# EAGLE design ThermoBot (EAGLE 7.6.0)
AUTHOR: w. boyett; CONTACT_ADDRESS: Licensed under CC-BY-SA; CONTACT_COMPANY: github.com/watsonboyett; CONTACT_PHONE: (Creative Commons, Attribution + Share Alike); REV: 1B
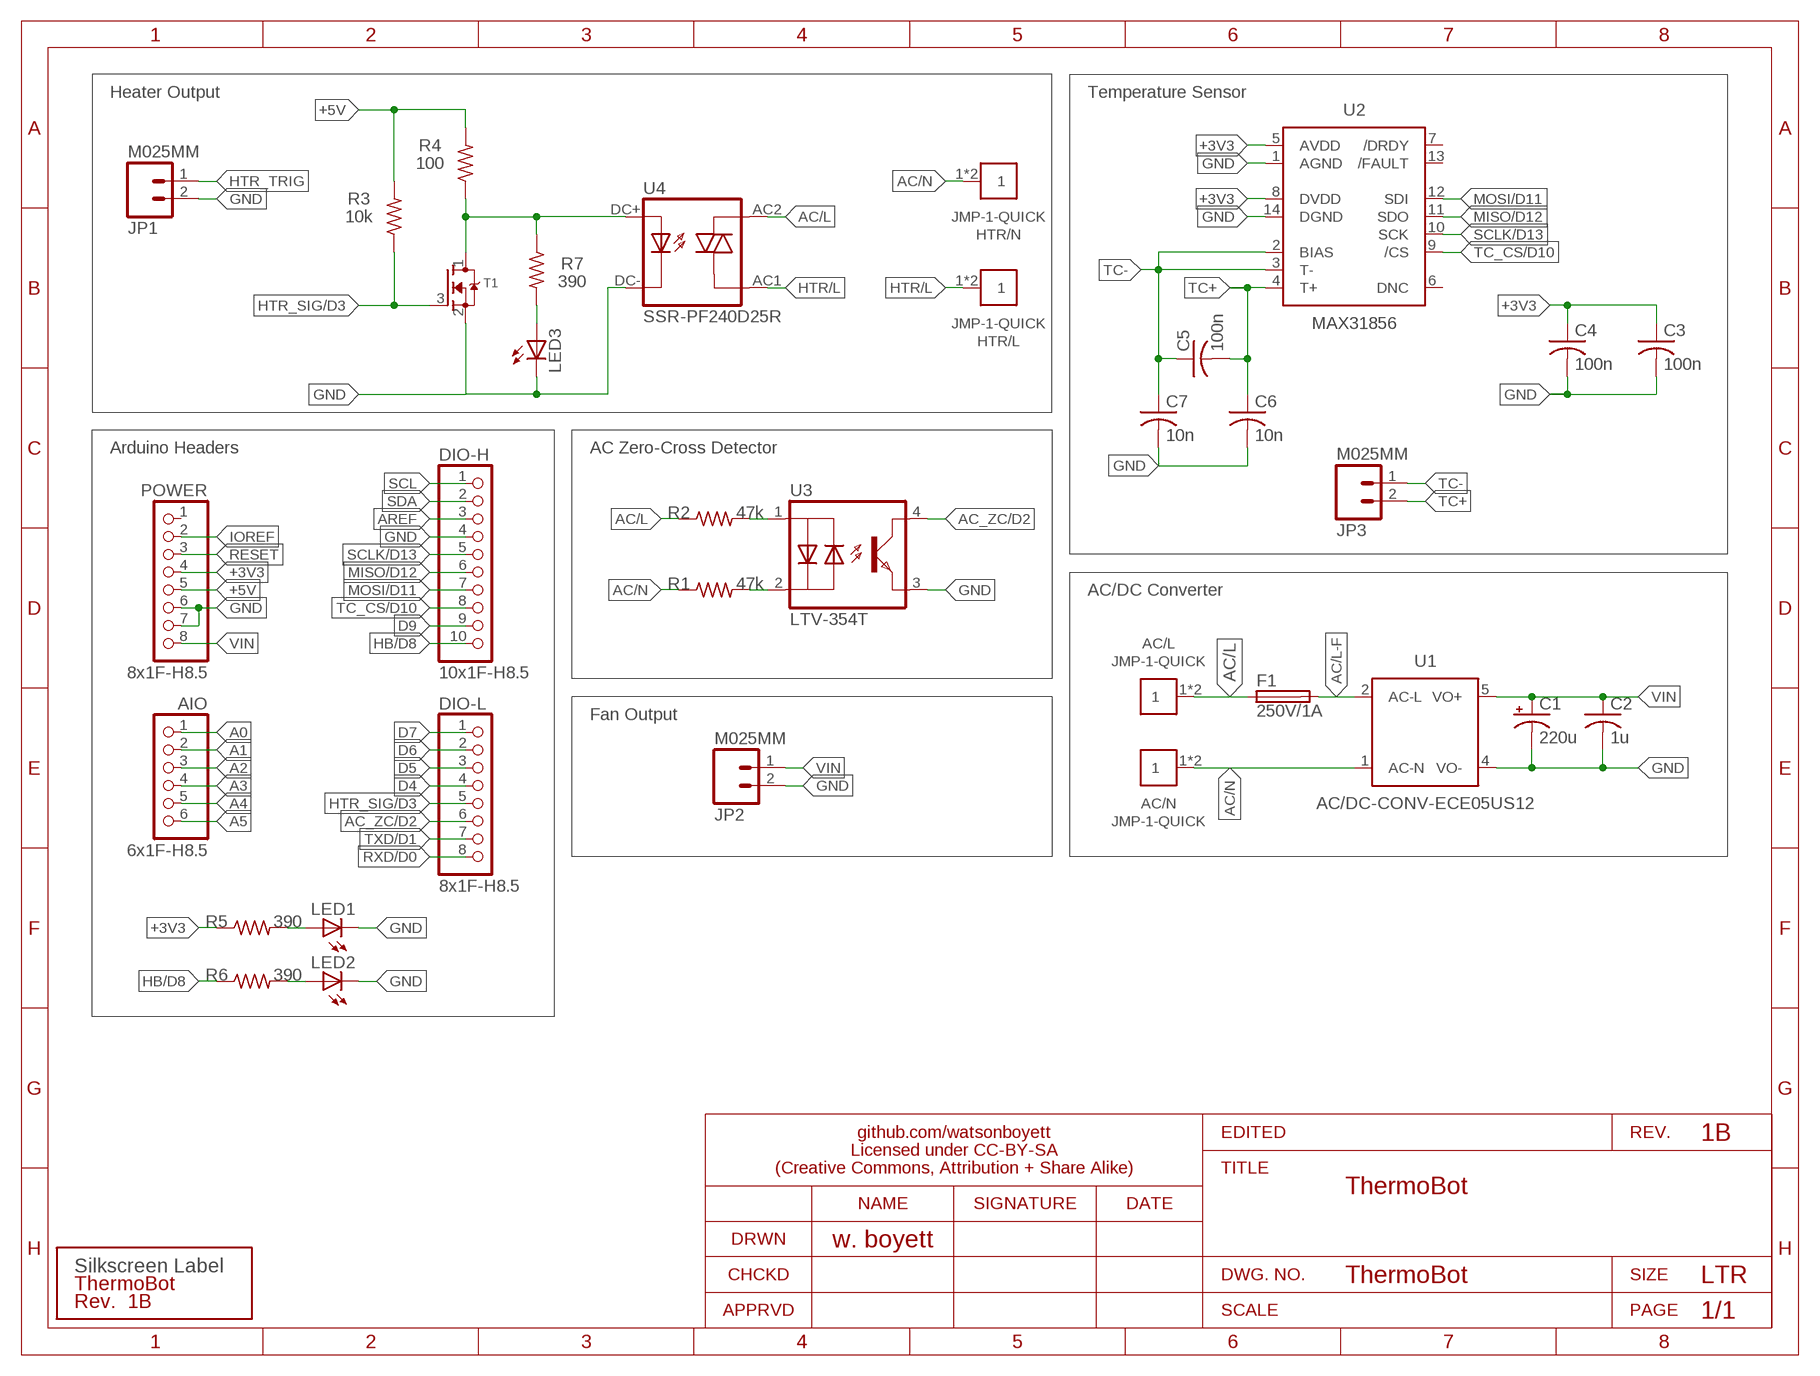
[diagram p0: schematic, sheet 1]

## Parts
AC/L  JMP-1-QUICK  [QUICK-1]
AC/N  JMP-1-QUICK  [QUICK-1]
AIO  6x1F-H8.5  PINHD-1X6TH  [1X06]
C1  220u  CPOL-US153CLV-1014  [153CLV-1014]
C2  1u  C-USC0805  [C0805]
C3  100n  C-USC0805  [C0805]
C4  100n  C-USC0805  [C0805]
C5  100n  C-USC0805  [C0805]
C6  10n  C-USC0805  [C0805]
C7  10n  C-USC0805  [C0805]
DIO-H  10x1F-H8.5  PINHD-1X10TH  [1X10]
DIO-L  8x1F-H8.5  PINHD-1X8TH  [1X08]
F1  250V/1A  FUSE2410  [2SMD-2410]
HTR/L  JMP-1-QUICK  [QUICK-1]
HTR/N  JMP-1-QUICK  [QUICK-1]
JP1  M025MM  [SCREWTERMINAL-5MM-2]
JP2  M025MM  [SCREWTERMINAL-5MM-2]
JP3  M025MM  [SCREWTERMINAL-5MM-2]
LED1  LEDCHIP-LED0805  [CHIP-LED0805]
LED2  LEDCHIP-LED0805  [CHIP-LED0805]
LED3  LEDCHIP-LED0805  [CHIP-LED0805]
POWER  8x1F-H8.5  PINHD-1X8TH  [1X08]
R1  47k  R-US_R1206  [R1206]
R2  47k  R-US_R1206  [R1206]
R3  10k  R-US_R0805  [R0805]
R4  100  R-US_R0805  [R0805]
R5  390  R-US_R0805  [R0805]
R6  390  R-US_R0805  [R0805]
R7  390  R-US_R0805  [R0805]
T1  MOSFET-N-SOT23  [SOT-23]
U1  AC/DC-CONV-ECE05US12  [ECE05]
U2  MAX31856  [TSSOP14]
U3  LTV-354T  [SOP-4]
U4  SSR-PF240D25R  [SIP-4]
U$1  SILK_QC  [SILK_QC]

## Nets
+3V3: C3.1 C4.1 POWER.4 R5.1 U2.5(AVDD) U2.8(DVDD)
+5V: POWER.5 R3.2 R4.2
A0: AIO.1
A1: AIO.2
A2: AIO.3
A3: AIO.4
A4: AIO.5
A5: AIO.6
AC/L [MAINS-HC]: AC/L.1 AC/L.2 F1.P$1 R2.1 U4.AC2(A2)
AC/L-F [MAINS-LC]: F1.P$2 U1.2(AC-L)
AC/N [MAINS-HC]: AC/N.1 AC/N.2 HTR/N.1 HTR/N.2 R1.1 U1.1(AC-N)
AC_ZC/D2: DIO-L.6 U3.4(COL)
AREF: DIO-H.3
D4: DIO-L.4
D5: DIO-L.3
D6: DIO-L.2
D7: DIO-L.1
D9: DIO-H.9
GND: C1.- C2.2 C3.2 C4.2 C6.2 C7.2 DIO-H.4 JP1.2 JP2.2 LED1.C LED2.C LED3.C POWER.6 POWER.7 T1.2(S1) U1.4(VO-) U2.1(AGND) U2.14(DGND) U3.3(EMIT) U4.DC-(C)
HB/D8: DIO-H.10 R6.1
HTR/L [MAINS-HC]: HTR/L.1 HTR/L.2 U4.AC1(A1)
HTR_SIG/D3: DIO-L.5 R3.1 T1.3(G1)
HTR_TRIG: JP1.1 R4.1 R7.1 T1.1(D1) U4.DC+(A)
IOREF: POWER.2
MISO/D12: DIO-H.6 U2.11(SDO)
MOSI/D11: DIO-H.7 U2.12(SDI)
N$3 [MAINS-LC]: R1.2 U3.2(C)
N$4 [MAINS-LC]: R2.2 U3.1(A)
N$6: LED3.A R7.2
N$7: LED1.A R5.2
N$9: LED2.A R6.2
RESET: POWER.3
RXD/D0: DIO-L.8
SCL: DIO-H.1
SCLK/D13: DIO-H.5 U2.10(SCK)
SDA: DIO-H.2
TC+: C5.2 C6.1 JP3.2 U2.4(T+)
TC-: C5.1 C7.1 JP3.1 U2.2(BIAS) U2.3(T-)
TC_CS/D10: DIO-H.8 U2.9(/CS)
TXD/D1: DIO-L.7
VIN: C1.+ C2.1 JP2.1 POWER.8 U1.5(VO+)
Unconnected: POWER.1 U2.6(DNC) U2.7(/DRDY) U2.13(/FAULT)

## Notes on the sheet
- Heater Output | Temperature Sensor
- Arduino Headers | AC Zero-Cross Detector
- AC/DC Converter
- Fan Output

## Library data of the parts
AC/L AC/N HTR/L HTR/N = ThermoBot:JMP-1; MPN: 1287; PN-DK: 36-1287-ND
AIO = ThermoBot:PINHD-1X6: PIN HEADER
C1 = ThermoBot:CPOL-US: POLARIZED CAPACITOR, American symbol; PN-DK: PCE3812CT-ND
C2-C7 = ThermoBot:C-US: CAPACITOR, American symbol
DIO-H = ThermoBot:PINHD-1X10: PIN HEADER
DIO-L POWER = ThermoBot:PINHD-1X8: PIN HEADER
F1 = ThermoBot:FUSE; MPN: 0454001.MR; PN-DK: F3144CT-ND
JP1-JP3 = ThermoBot:M02: 2-pin header 0.1" headers for use with - straight break away headers ( PRT-00116) - right angle break away headers (PRT-00553) - swiss pins (PRT-00743) - machine pins (PRT-00117) - female headers (PRT-00115) Molex polarized connector foot print use with: PRT-08233 with associated crimp pins and housings. 2.54_SCREWTERM for use with PRT-10571. 3.5mm Screw Terminal footprints for PRT-08084 5mm Screw Terminal footprints for use with PRT-08432; MPN: 1729128; PN-DK: 277-1247-ND
LED1 = ThermoBot:LED: LED OSRAM: - CHIPLED LG R971, LG N971, LY N971, LG Q971, LY Q971, LO R971, LY R971 LH N974, LH R974 LS Q976, LO Q976, LY Q976 LO Q996 - Hyper CHIPLED LW Q18S LB Q993, LB Q99A, LB R99A - SideLED LS A670, LO A670, LY A670, LG A670, LP A670 LB A673, LV A673, LT A673, LW A673 LH A674 LY A675 LS A676, LA A676, LO A676, LY A676, LW A676 LS A679, LY A679, LG A679 - Hyper Micro SIDELED® LS Y876, LA Y876, LO Y876, LY Y876 LT Y87S - SmartLED LW L88C, LW L88S LB L89C, LB L89S, LG L890 LS L89K, LO L89K, LY L89K LS L896, LA L896, LO L896, LY L896 - TOPLED LS T670, LO T670, LY T670, LG T670, LP T670 LSG T670, LSP T670, LSY T670, LOP T670, LYG T670 LG T671, LOG T671, LSG T671 LB T673, LV T673, LT T673, LW T673 LH T674 LS T676, LA T676, LO T676, LY T676, LB T676, LH T676, LSB T676, LW T676 LB T67C, LV T67C, LT T67C, LS T67K, LO T67K, LY T67K, LW E67C LS E67B, LA E67B, LO E67B, LY E67B, LB E67C, LV E67C, LT E67C LW T67C LS T679, LY T679, LG T679 LS T770, LO T770, LY T770, LG T770, LP T770 LB T773, LV T773, LT T773, LW T773 LH T774 LS E675, LA E675, LY E675, LS T675 LS T776, LA T776, LO T776, LY T776, LB T776 LHGB T686 LT T68C, LB T68C - Hyper Mini TOPLED® LB M676 - Mini TOPLED Santana® LG M470 LS M47K, LO M47K, LY M47K Source: http://www.osram.convergy.de LUXEON: - LUMILED® LXK2-PW12-R00, LXK2-PW12-S00, LXK2-PW14-U00, LXK2-PW14-V00 LXK2-PM12-R00, LXK2-PM12-S00, LXK2-PM14-U00 LXK2-PE12-Q00, LXK2-PE12-R00, LXK2-PE12-S00, LXK2-PE14-T00, LXK2-PE14-U00 LXK2-PB12-K00, LXK2-PB12-L00, LXK2-PB12-M00, LXK2-PB14-N00, LXK2-PB14-P00, LXK2-PB14-Q00 LXK2-PR12-L00, LXK2-PR12-M00, LXK2-PR14-Q00, LXK2-PR14-R00 LXK2-PD12-Q00, LXK2-PD12-R00, LXK2-PD12-S00 LXK2-PH12-R00, LXK2-PH12-S00 LXK2-PL12-P00, LXK2-PL12-Q00, LXK2-PL12-R00 Source: www.luxeon.com KINGBRIGHT: KA-3528ASYC Source: www.kingbright.com; LABEL: PWR; MPN: SML-LXT0805IW-TR; PN-DK: 67-1552-1-ND
LED2 = ThermoBot:LED: LED OSRAM: - CHIPLED LG R971, LG N971, LY N971, LG Q971, LY Q971, LO R971, LY R971 LH N974, LH R974 LS Q976, LO Q976, LY Q976 LO Q996 - Hyper CHIPLED LW Q18S LB Q993, LB Q99A, LB R99A - SideLED LS A670, LO A670, LY A670, LG A670, LP A670 LB A673, LV A673, LT A673, LW A673 LH A674 LY A675 LS A676, LA A676, LO A676, LY A676, LW A676 LS A679, LY A679, LG A679 - Hyper Micro SIDELED® LS Y876, LA Y876, LO Y876, LY Y876 LT Y87S - SmartLED LW L88C, LW L88S LB L89C, LB L89S, LG L890 LS L89K, LO L89K, LY L89K LS L896, LA L896, LO L896, LY L896 - TOPLED LS T670, LO T670, LY T670, LG T670, LP T670 LSG T670, LSP T670, LSY T670, LOP T670, LYG T670 LG T671, LOG T671, LSG T671 LB T673, LV T673, LT T673, LW T673 LH T674 LS T676, LA T676, LO T676, LY T676, LB T676, LH T676, LSB T676, LW T676 LB T67C, LV T67C, LT T67C, LS T67K, LO T67K, LY T67K, LW E67C LS E67B, LA E67B, LO E67B, LY E67B, LB E67C, LV E67C, LT E67C LW T67C LS T679, LY T679, LG T679 LS T770, LO T770, LY T770, LG T770, LP T770 LB T773, LV T773, LT T773, LW T773 LH T774 LS E675, LA E675, LY E675, LS T675 LS T776, LA T776, LO T776, LY T776, LB T776 LHGB T686 LT T68C, LB T68C - Hyper Mini TOPLED® LB M676 - Mini TOPLED Santana® LG M470 LS M47K, LO M47K, LY M47K Source: http://www.osram.convergy.de LUXEON: - LUMILED® LXK2-PW12-R00, LXK2-PW12-S00, LXK2-PW14-U00, LXK2-PW14-V00 LXK2-PM12-R00, LXK2-PM12-S00, LXK2-PM14-U00 LXK2-PE12-Q00, LXK2-PE12-R00, LXK2-PE12-S00, LXK2-PE14-T00, LXK2-PE14-U00 LXK2-PB12-K00, LXK2-PB12-L00, LXK2-PB12-M00, LXK2-PB14-N00, LXK2-PB14-P00, LXK2-PB14-Q00 LXK2-PR12-L00, LXK2-PR12-M00, LXK2-PR14-Q00, LXK2-PR14-R00 LXK2-PD12-Q00, LXK2-PD12-R00, LXK2-PD12-S00 LXK2-PH12-R00, LXK2-PH12-S00 LXK2-PL12-P00, LXK2-PL12-Q00, LXK2-PL12-R00 Source: www.luxeon.com KINGBRIGHT: KA-3528ASYC Source: www.kingbright.com; LABEL: HB; MPN: SML-LXT0805IW-TR; PN-DK: 67-1552-1-ND
LED3 = ThermoBot:LED: LED OSRAM: - CHIPLED LG R971, LG N971, LY N971, LG Q971, LY Q971, LO R971, LY R971 LH N974, LH R974 LS Q976, LO Q976, LY Q976 LO Q996 - Hyper CHIPLED LW Q18S LB Q993, LB Q99A, LB R99A - SideLED LS A670, LO A670, LY A670, LG A670, LP A670 LB A673, LV A673, LT A673, LW A673 LH A674 LY A675 LS A676, LA A676, LO A676, LY A676, LW A676 LS A679, LY A679, LG A679 - Hyper Micro SIDELED® LS Y876, LA Y876, LO Y876, LY Y876 LT Y87S - SmartLED LW L88C, LW L88S LB L89C, LB L89S, LG L890 LS L89K, LO L89K, LY L89K LS L896, LA L896, LO L896, LY L896 - TOPLED LS T670, LO T670, LY T670, LG T670, LP T670 LSG T670, LSP T670, LSY T670, LOP T670, LYG T670 LG T671, LOG T671, LSG T671 LB T673, LV T673, LT T673, LW T673 LH T674 LS T676, LA T676, LO T676, LY T676, LB T676, LH T676, LSB T676, LW T676 LB T67C, LV T67C, LT T67C, LS T67K, LO T67K, LY T67K, LW E67C LS E67B, LA E67B, LO E67B, LY E67B, LB E67C, LV E67C, LT E67C LW T67C LS T679, LY T679, LG T679 LS T770, LO T770, LY T770, LG T770, LP T770 LB T773, LV T773, LT T773, LW T773 LH T774 LS E675, LA E675, LY E675, LS T675 LS T776, LA T776, LO T776, LY T776, LB T776 LHGB T686 LT T68C, LB T68C - Hyper Mini TOPLED® LB M676 - Mini TOPLED Santana® LG M470 LS M47K, LO M47K, LY M47K Source: http://www.osram.convergy.de LUXEON: - LUMILED® LXK2-PW12-R00, LXK2-PW12-S00, LXK2-PW14-U00, LXK2-PW14-V00 LXK2-PM12-R00, LXK2-PM12-S00, LXK2-PM14-U00 LXK2-PE12-Q00, LXK2-PE12-R00, LXK2-PE12-S00, LXK2-PE14-T00, LXK2-PE14-U00 LXK2-PB12-K00, LXK2-PB12-L00, LXK2-PB12-M00, LXK2-PB14-N00, LXK2-PB14-P00, LXK2-PB14-Q00 LXK2-PR12-L00, LXK2-PR12-M00, LXK2-PR14-Q00, LXK2-PR14-R00 LXK2-PD12-Q00, LXK2-PD12-R00, LXK2-PD12-S00 LXK2-PH12-R00, LXK2-PH12-S00 LXK2-PL12-P00, LXK2-PL12-Q00, LXK2-PL12-R00 Source: www.luxeon.com KINGBRIGHT: KA-3528ASYC Source: www.kingbright.com; LABEL: TRIG; MPN: SML-LXT0805IW-TR; PN-DK: 67-1552-1-ND
R1-R7 = ThermoBot:R-US_: RESISTOR, American symbol
T1 = SmslsTron:MOSFET-N: MOS FET
U1 = ThermoBot:AC/DC-CONV; MFG: XP Power; MPN: ECE05US12; PN-DK: 1470-1110-ND
U2 = ThermoBot:MAX31856; MPN: MAX31856MUD+; PN-DK: MAX31856MUD+-ND
U3 = ThermoBot:LTV-354T; MPN: LTV-354T; PN-DK: 160-1333-1-ND
U4 = ThermoBot:SSR; MFG: Crydom Co.; MPN: PF240D25R; PN-DK: CC1607-ND
U$1 = ThermoBot:SILK_QC: Model/Version Tag Silkscreen; MPN: DNP; PRODUCT: ThermoBot; REV: 1B

## Net classes
0 default: width 0.254 mm, clearance 0.254 mm
1 MAINS-LC: width 0.508 mm, drill 0.381 mm, clearance 2.159 mm
2 MAINS-HC: width 1.27 mm, drill 0.508 mm, clearance 2.159 mm

## Board
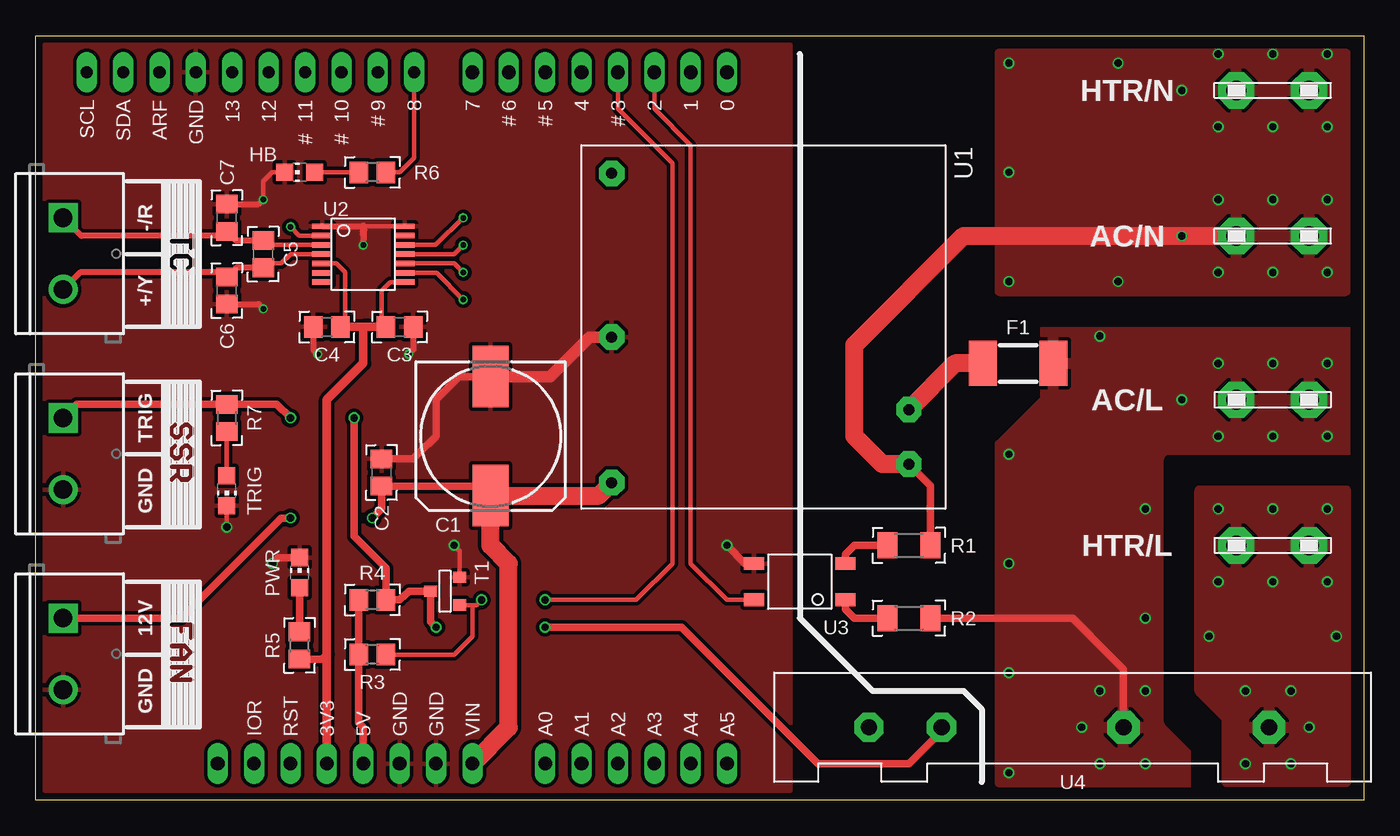
[diagram p1: board, top side]
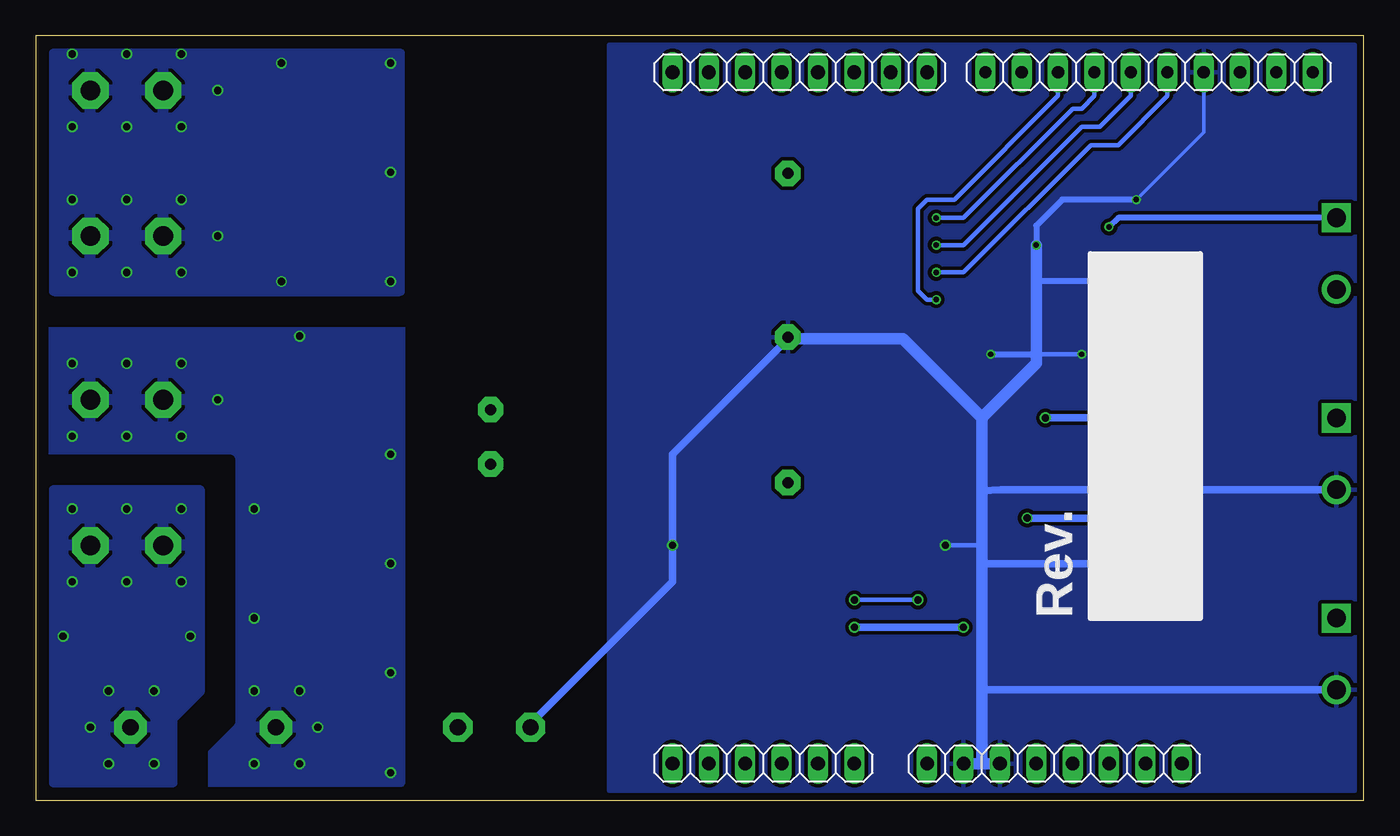
[diagram p2: board, bottom side, seen from below]

Size 92.71 x 53.34 mm. Coordinates in mm from the lower left corner, seen from the top.
Outline: 0,0 0,53.34 92.71,53.34 92.71,0 0,0
Copper layers (1*16): Top 0.035559375mm / dielectric 1.6mm / Bottom 0.035559375mm
Design rules "OshPark-2layer *": minimum track width 6mil, minimum drill 10mil, track to track 6mil, track to pad 6mil, pad to pad 6mil, via to via 6mil, smd to smd 6mil, copper to edge 15mil, drill to drill 6mil, minimum pad ring 5mil, minimum via ring 5mil, stop-mask expansion 2.5mil, vias tented up to drill 21mil, thermal gap 10mil

### Footprints (pad centres in the part's own frame; a part is rotated, then mirrored left to right if it is on the bottom)
QUICK-1 = drill 1.372 pad 2.54 octagon: 1 -2.54,0; 2 2.54,0
1X06 = drill 0.95 pad 1.422 long: 1 -6.35,0; 2 -3.81,0; 3 -1.27,0; 4 1.27,0; 5 3.81,0; 6 6.35,0
153CLV-1014 = smd 4.3 x 2.5: + 4.15,0; - -4.15,0
C0805 = smd 1.3 x 1.5: 1 -0.95,0; 2 0.95,0
1X10 = drill 0.85 pad 1.422 long: 1 -11.43,0; 2 -8.89,0; 3 -6.35,0; 4 -3.81,0; 5 -1.27,0; 6 1.27,0; 7 3.81,0; 8 6.35,0; 9 8.89,0; 10 11.43,0
1X08 = drill 0.95 pad 1.422 long: 1 -8.89,0; 2 -6.35,0; 3 -3.81,0; 4 -1.27,0; 5 1.27,0; 6 3.81,0; 7 6.35,0; 8 8.89,0
2SMD-2410 = smd 1.956 x 3.15: P$1 -2.464,0; P$2 2.464,0
SCREWTERMINAL-5MM-2 = drill 1.3 pad 2.032 square: 1 0,0 | drill 1.3 pad 2.032: 2 5,0
CHIP-LED0805 = smd 1.2 x 1.2: A 1.05,0; C -1.05,0
R1206 = smd 1.4 x 1.8: 1 -1.5,0; 2 1.5,0
R0805 = smd 1.3 x 1.5: 1 -0.95,0; 2 0.95,0
SOT-23 = smd 0.889 x 0.787: 1 -1.016,-0.025; 2 1.016,0.94; 3 1.016,-0.991
ECE05 = drill 0.762 pad 1.778 octagon: 1 -10.16,9.576; 2 -10.16,5.766; 3 10.592,-10.719; 4 10.592,0.711; 5 10.592,10.871
TSSOP14 = smd 0.38 x 1.4: 1 -1.95,-2.875; 2 -1.3,-2.875; 3 -0.65,-2.875; 4 0,-2.875; 5 0.65,-2.875; 6 1.3,-2.875; 7 1.95,-2.875; 8 1.95,2.875; 9 1.3,2.875; 10 0.65,2.875; 11 0,2.875; 12 -0.65,2.875; 13 -1.3,2.875; 14 -1.95,2.875
SOP-4 = smd 1.4 x 0.9: 1 3.2,-1.27; 2 3.2,1.27; 3 -3.2,1.27; 4 -3.2,-1.27
SIP-4 = drill 1.143 pad 2.286 octagon: AC1 -13.716,0; AC2 -3.556,0 | drill 1.143 pad 2.032 octagon: DC+ 9.144,0; DC- 14.224,0

### Placement (x,y rotation side)
AC/L  86.36,27.94 0 top
AC/N  86.36,39.37 180 top
AIO  41.91,2.54 180 bottom
C1  31.75,25.4 270 top
C2  24.13,22.86 90 top
C3  25.4,33.02 0 top
C4  20.32,33.02 180 top
C5  15.88,38.1 270 top
C6  13.34,35.56 270 top
C7  13.34,40.64 90 top
DIO-H  14.99,50.8 180 bottom
DIO-L  39.37,50.8 180 bottom
F1  68.58,30.48 180 top
HTR/L  86.36,17.78 0 top
HTR/N  86.36,49.53 180 top
JP1  1.91,26.67 270 top
JP2  1.91,12.7 270 top
JP3  1.91,40.64 270 top
LED1  18.41,15.88 270 top
LED2  18.41,43.81 0 top
LED3  13.34,21.59 90 top
POWER  21.59,2.54 180 bottom
R1  60.96,17.78 180 top
R2  60.96,12.7 180 top
R3  23.5,10.16 180 top
R4  23.5,13.97 180 top
R5  18.41,10.79 90 top
R6  23.5,43.81 180 top
R7  13.34,26.67 270 top
T1  28.57,14.61 0 top
U1  50.8,33.02 180 top
U2  22.86,38.1 270 top
U3  53.34,15.24 0 top
U4  72.39,5.08 180 top
U$1  20.32,12.7 90 bottom
U$2  [SILK_FAN]  8.89,10.16 270 top
U$3  [SILK_SSR]  8.89,24.13 270 top
U$4  [SILK_TC]  8.89,38.1 270 top

### Tracks (layer width: path | path; a pad name or v marks a point on that pad's centre or on a via)
+3V3
  Top 0.305: 21.59,33.34 21.59,36.83 20.97,37.45 U2.5 | 24.13,33.34 24.13,35.56 24.72,36.15 U2.8
  Top 0.406: 21.59,33.34 C4.1 | 24.13,33.34 C3.1
  Top 0.508: R5.1 20,9.85 20.32,10.16
  Top 0.61: 22.86,33.02 22.86,30.48 20.32,27.94 20.32,10.16 POWER.4 | C3.1 22.86,33.02 | C4.1 22.86,33.02
+5V
  Top 0.508: R4.2 R3.2 22.55,5.39 22.86,5.08 POWER.5
AC/L  (via drill 0.51)
  Top 0.508: R2.1 72.39,12.7 74.93,10.16 75.95,9.14 U4.AC2
  other vias: 77.47,7.62 74.3,7.62 74.3,2.54 77.47,2.54 86.36,30.48 86.36,25.4 82.55,25.4 82.55,30.48 90.17,30.48 90.17,25.4 73.03,5.08 80.01,27.94 67.94,24.13 67.94,1.91 67.94,16.51 67.94,8.89 74.3,32.38 77.47,20.32 77.47,12.7
  pour Top (rank 2): 91.44,33.02 70.48,33.02 70.48,27.94 67.31,24.77 67.31,1.27 91.44,1.27
  pour Bottom (rank 2): 91.44,33.02 67.31,33.02 67.31,1.27 91.44,1.27
AC/L-F
  Top 1.27: F1.P$2 64.19,30.48 U1.2
AC/N  (via drill 0.51)
  Top 0.508: R1.1 62.46,21.94 U1.1
  Top 1.27: U1.1 59.11,23.44 57.15,25.4 57.15,31.75 64.77,39.37 AC/N.2
  other vias: 86.36,36.83 86.36,41.91 90.17,41.91 90.17,36.83 82.55,36.83 82.55,41.91 82.55,46.99 86.36,46.99 90.17,46.99 82.55,52.07 86.36,52.07 90.17,52.07 80.01,49.53 80.01,39.37 67.94,51.44 67.94,36.2 75.56,51.44 75.56,36.2 67.94,43.81
  pour Top: 67.31,52.07 67.31,35.56 91.44,35.56 91.44,52.07
  pour Bottom: 91.44,52.07 91.44,35.56 67.31,35.56 67.31,52.07
AC_ZC/D2
  Top 0.305: DIO-L.6 43.18,48.26 45.72,45.72 45.72,16.51 48.26,13.97 U3.4
GND  (via drill 0.38, 0.51)
  Top 0.305: U2.14 22.91,40.05 | v15.88,41.91 15.88,43.18 16.51,43.81 LED2.C | LED3.C v13.34,19.05 | T1.2 29.59,17.4 v29.21,17.78
  Top 0.406: U2.1 22.82,40.05 | 22.82,40.05 v22.86,38.73 22.91,40.05 | 22.86,40.09 22.82,40.05 | C7.2 15.55,41.59 v15.88,41.91 | C6.2 15.55,34.61 v15.88,34.29 | C3.2 26.35,31.43 v26.04,31.11 | C4.2 19.37,31.43 v19.68,31.11
  Top 0.508: C2.2 26.01,23.81 26.35,23.81 26.67,24.13 27.94,25.4 27.94,27.94 29.55,29.55 C1.- | LED1.C 16.93,16.93 v16.51,16.51 | U3.3 49.53,16.51 v48.26,17.78
  Top 0.813: U1.4 38.66,32.31 36.83,30.48 35.9,29.55 C1.-
  Bottom 0.254: DIO-H.4 11.18,46.61 v15.88,41.91
  Bottom 0.305: v19.68,31.11 22.86,31.11 | U1.4 40.21,32.18 | v13.34,19.05 13.34,21.67 | v29.21,17.78 26.67,17.78
  Bottom 0.406: v15.88,41.91 21.05,41.91 22.86,40.09 v22.86,38.73 | v15.88,34.29 17.78,36.2 22.86,36.2 | v26.04,31.11 22.86,31.11
  Bottom 0.508: JP2.2 26.59,7.7 26.67,7.62 | v16.51,16.51 26.67,16.51 | JP1.2 13.34,21.67 25.32,21.67 26.67,21.59 | U4.DC- 58.17,5.33 48.26,15.24 v48.26,17.78 48.26,24.13 40.21,32.18
  Bottom 0.813: 26.67,2.54 26.67,7.62 26.67,17.78 | 26.67,17.78 26.67,16.51 26.67,17.78 | 26.67,17.78 26.67,21.59 26.67,26.67 | 26.67,26.67 22.86,30.48 22.86,31.11 22.86,36.2 v22.86,38.73 | POWER.7 26.67,2.54 | 26.67,2.54 POWER.6 | 26.67,26.67 32.18,32.18 40.21,32.18
  pour Bottom (isolate 0.254, rank 2): 0.64,52.7 0.64,0.64 52.7,0.64 52.7,52.7
  pour Top (isolate 0.254, rank 2): 0.64,52.7 0.64,0.64 52.7,0.64 52.7,52.7
HB/D8
  Top 0.305: DIO-H.10 26.42,45.97 26.42,44.83 26.04,44.45 25.4,43.81 R6.1
HTR/L  (via drill 0.51)
  other vias: 84.45,7.62 87.63,7.62 87.63,2.54 84.45,2.54 82.55,20.32 90.17,20.32 86.36,20.32 86.36,15.24 82.55,15.24 90.17,15.24 88.9,5.08 81.92,11.43 90.81,11.43
  pour Top: 83.19,1.27 83.19,5.71 81.28,7.62 81.28,21.59 91.44,21.59 91.44,1.27
  pour Bottom: 83.19,1.27 83.19,5.71 81.28,7.62 81.28,21.59 91.44,21.59 91.44,1.27
HTR_SIG/D3  (via drill 0.51)
  Top 0.305: DIO-L.5 40.64,48.26 44.45,44.45 44.45,16.51 41.91,13.97 v35.56,13.97 | T1.3 30.48,13.61 | 30.48,13.61 30.76,13.61 v31.11,13.97 | 30.48,13.61 30.48,11.43 29.21,10.16 25.4,10.16 R3.1
  Bottom 0.305: v35.56,13.97 33.66,13.97 v31.11,13.97
HTR_TRIG  (via drill 0.51)
  Top 0.508: U4.DC+ 63.25,4.83 60.96,2.54 54.61,2.54 45.09,12.06 v35.56,12.06 | JP1.1 2.85,27.62 R7.1 16.83,27.62 v17.78,26.67 | v22.23,26.67 22.23,18.41 24.45,16.2 R4.1 25.4,13.97 26.06,14.58 T1.1 27.56,12.45 v27.94,12.06
  Bottom 0.508: v17.78,26.67 v22.23,26.67 | v27.94,12.06 34.92,12.06 v35.56,12.06
MISO/D12  (via drill 0.38)
  Top 0.305: U2.11 29.21,38.1 v29.84,38.73
  Bottom 0.305: v29.84,38.73 27.94,38.73 19.68,46.99 18.41,46.99 16.26,49.15 DIO-H.6
MOSI/D11  (via drill 0.38)
  Top 0.305: U2.12 27.93,38.75 v29.84,40.64
  Bottom 0.305: v29.84,40.64 27.94,40.64 20.32,48.26 19.68,48.26 18.8,49.15 DIO-H.7
N$3
  Top 0.508: U3.2 56.54,17.17 57.15,17.78 R1.2
N$4
  Top 0.508: U3.1 56.54,13.31 57.15,12.7 R2.2
N$6
  Top 0.305: R7.2 LED3.A
N$7
  Top 0.508: R5.2 LED1.A
N$9
  Top 0.305: LED2.A R6.2
SCLK/D13  (via drill 0.38)
  Top 0.305: U2.10 29.2,37.45 v29.84,36.83
  Bottom 0.305: v29.84,36.83 27.94,36.83 19.05,45.72 17.14,45.72 13.72,49.15 DIO-H.5
TC+
  Top 0.305: U2.4 17.78,38.1 17.14,37.47 16.19,37.47
  Top 0.406: 16.19,37.47 C5.2 13.97,37.15 C6.1 13.02,36.83 3.1,36.83 JP3.2
TC-  (via drill 0.38)
  Top 0.305: U2.3 16.18,38.75 | U2.2 18.39,39.4 v17.78,40.01
  Top 0.406: 16.18,38.75 C5.1 13.97,39.05 C7.1 13.02,39.37 3.17,39.37 JP3.1
  Bottom 0.406: JP3.1 17.14,40.64 v17.78,40.01
TC_CS/D10  (via drill 0.38)
  Top 0.305: U2.9 27.97,36.8 v29.84,34.92
  Bottom 0.305: v29.84,34.92 30.48,34.92 31.11,35.56 31.11,41.27 30.48,41.91 28.57,41.91 21.34,49.15 DIO-H.8
VIN  (via drill 0.51)
  Top 0.508: C1.+ 31.09,21.91 C2.1 24.13,20.32 v23.5,19.68 | v17.78,19.68 17.14,19.68 10.16,12.7 JP2.1
  Top 1.27: U1.5 39.31,21.25 C1.+ 31.75,17.78 33.02,16.51 33.02,5.08 POWER.8
  Bottom 0.508: v23.5,19.68 v17.78,19.68

### Text on the board
tNames: SCL | SDA | ARF | GND | 13 | 12 | 11 | 10 | 9 | 8 | 7 | 6 | 5 | 4 | 3 | 2 | 1 | 0 | # | # | # | # | # | # | IOR | RST | 3V3 | 5V | GND | GND | VIN | A0 | A1 | A2 | A3 | A4 | A5
214bmp: D:/SmartProjects/Snc/a4_bn_logo2.bmp